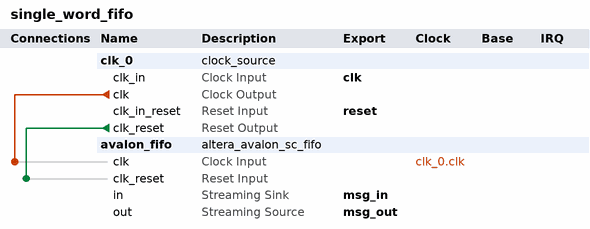
[diagram p0: system contents]
# Platform Designer (Qsys) system single_word_fifo, Cyclone V 5CSXFC6D6F31I7
# Parameters at their usual value, and those the tool derives, are not listed.
package require -exact qsys 19.1
create_system single_word_fifo
set_project_property DEVICE_FAMILY {Cyclone V}
set_project_property DEVICE 5CSXFC6D6F31I7

add_instance clk_0 clock_source 19.1
set_instance_parameter_value clk_0 clockFrequency 50000000

add_instance avalon_fifo altera_avalon_sc_fifo 19.1
set_instance_parameter_value avalon_fifo BITS_PER_SYMBOL 8
set_instance_parameter_value avalon_fifo CHANNEL_WIDTH 0
set_instance_parameter_value avalon_fifo ERROR_WIDTH 0
set_instance_parameter_value avalon_fifo FIFO_DEPTH 1
set_instance_parameter_value avalon_fifo SYMBOLS_PER_BEAT 4
set_instance_parameter_value avalon_fifo USE_FILL_LEVEL 0
set_instance_parameter_value avalon_fifo USE_MEMORY_BLOCKS 1
set_instance_parameter_value avalon_fifo USE_PACKETS 1
set_instance_parameter_value avalon_fifo USE_STORE_FORWARD 0

# connections
add_connection clk_0.clk avalon_fifo.clk clock
add_connection clk_0.clk_reset avalon_fifo.clk_reset reset

# exported interfaces
add_interface clk clock sink
set_interface_property clk EXPORT_OF clk_0.clk_in
add_interface msg_in avalon_streaming sink
set_interface_property msg_in EXPORT_OF avalon_fifo.in
add_interface msg_out avalon_streaming source
set_interface_property msg_out EXPORT_OF avalon_fifo.out
add_interface reset reset sink
set_interface_property reset EXPORT_OF clk_0.clk_in_reset

set_interconnect_requirement {$system} qsys_mm.clockCrossingAdapter HANDSHAKE
set_interconnect_requirement {$system} qsys_mm.enableEccProtection FALSE
set_interconnect_requirement {$system} qsys_mm.insertDefaultSlave FALSE
set_interconnect_requirement {$system} qsys_mm.maxAdditionalLatency 1

save_system single_word_fifo.qsys
